# EAGLE design ESP32_DAB (EAGLE 9.6.2)
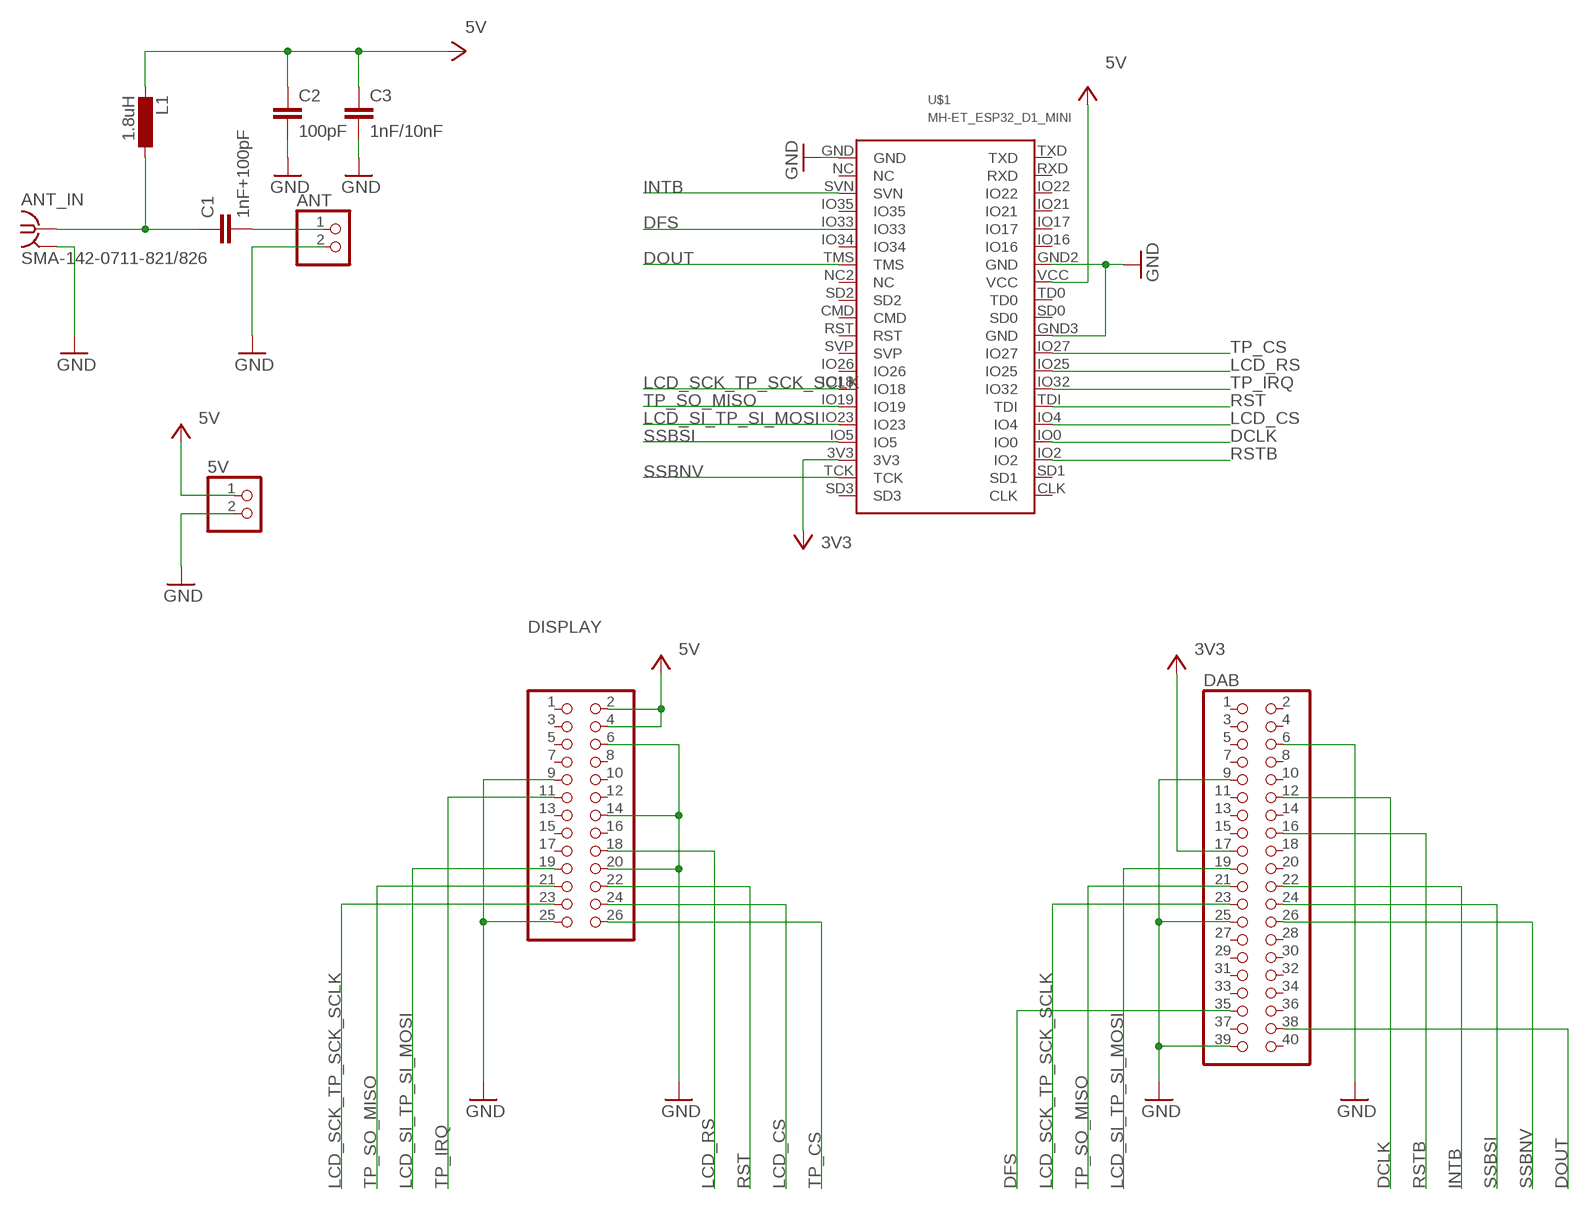
[diagram p0: schematic, sheet 1]

## Parts
5V  PINHD-1X2  [1X02]
ANT  PINHD-1X2  [1X02]
ANT_IN  SMA-142-0711-821/826  [J502-ND-142-0711-821/826]
C1  1nF+100pF  C-EUC0805  [C0805]
C2  100pF  C-EUC0805  [C0805]
C3  1nF/10nF  C-EUC0805  [C0805]
DAB  PINHD-2X20  [2X20]
DISPLAY  PINHD-2X13  [2X13]
L1  1.8uH  L-EUL1812  [L1812]
U$1  MH-ET_ESP32_D1_MINI  [MH-ET_ESP32_D1_MINI]

## Nets
3V3: DAB.17 U$1.3V3 ; supply symbol labelled VCC
5V: 5V.1 C2.1 C3.1 DISPLAY.2 DISPLAY.4 L1.2 U$1.VCC ; supply symbol labelled VCC
DCLK: DAB.12 U$1.IO0
DFS: DAB.35 U$1.IO33
DOUT: DAB.38 U$1.TMS
GND: 5V.2 ANT.2 ANT_IN.G@1 ANT_IN.G@2 ANT_IN.G@3 ANT_IN.G@4 C2.2 C3.2 DAB.6 DAB.9 DAB.25 DAB.39 DISPLAY.6 DISPLAY.9 DISPLAY.14 DISPLAY.20 DISPLAY.25 U$1.GND U$1.GND2(GND) U$1.GND3(GND)
INTB: DAB.22 U$1.SVN
LCD_CS: DISPLAY.24 U$1.IO4
LCD_RS: DISPLAY.18 U$1.IO25
LCD_SCK_TP_SCK_SCLK: DAB.23 DISPLAY.23 U$1.IO18
LCD_SI_TP_SI_MOSI: DAB.19 DISPLAY.19 U$1.IO23
N$1: ANT_IN.1 C1.1 L1.1
N$2: ANT.1 C1.2
RST: DISPLAY.22 U$1.TDI
RSTB: DAB.16 U$1.IO2
SSBNV: DAB.26 U$1.TCK
SSBSI: DAB.24 U$1.IO5
TP_CS: DISPLAY.26 U$1.IO27
TP_IRQ: DISPLAY.11 U$1.IO32
TP_SO_MISO: DAB.21 DISPLAY.21 U$1.IO19
Unconnected: DAB.1 DAB.2 DAB.3 DAB.4 DAB.5 DAB.7 DAB.8 DAB.10 DAB.11 DAB.13 DAB.14 DAB.15 DAB.18 DAB.20 DAB.27 DAB.28 DAB.29 DAB.30 DAB.31 DAB.32 DAB.33 DAB.34 DAB.36 DAB.37 DAB.40 DISPLAY.1 DISPLAY.3 DISPLAY.5 DISPLAY.7 DISPLAY.8 DISPLAY.10 DISPLAY.12 DISPLAY.13 DISPLAY.15 DISPLAY.16 DISPLAY.17 U$1.CLK U$1.CMD U$1.IO16 U$1.IO17 U$1.IO21 U$1.IO22 U$1.IO26 U$1.IO34 U$1.IO35 U$1.NC U$1.NC2(NC) U$1.RST U$1.RXD U$1.SD0 U$1.SD1 U$1.SD2 U$1.SD3 U$1.SVP U$1.TD0 U$1.TXD

## Library data of the parts
5V ANT = pinhead:PINHD-1X2: PIN HEADER
ANT_IN = con-coax:SMA-: SMA 50 Ohm End Launch Jack Receptacle - Round Contact Johnson Components Source: www.johnsoncomponents.com .. J502-ND.pdf; MF: JOHNSON COMPONENTS; MPN: 142-0711-821; OC_FARNELL: 1019328; OC_NEWARK: 16F3627
C1-C3 = rcl:C-EU: CAPACITOR, European symbol; SPICEPREFIX: C
DAB = pinhead:PINHD-2X20: PIN HEADER
DISPLAY = pinhead:PINHD-2X13: PIN HEADER
L1 = rcl:L-EU: INDUCTOR, European symbol; SPICEPREFIX: L
U$1 = MH-ET_ESP32_D1_MINI:MH-ET_ESP32_D1_MINI

## Board
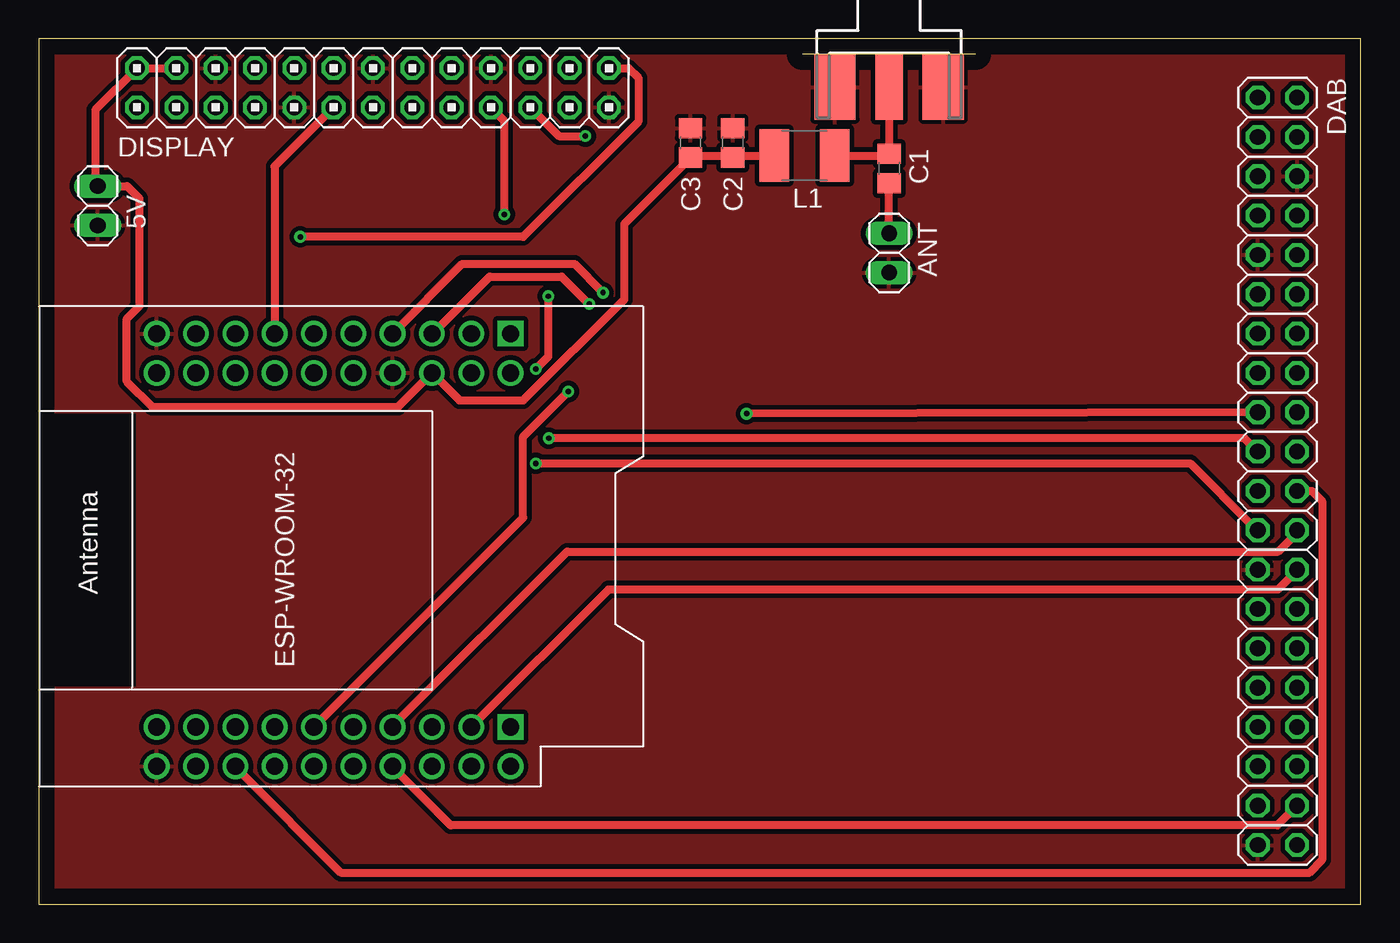
[diagram p1: board, top side]
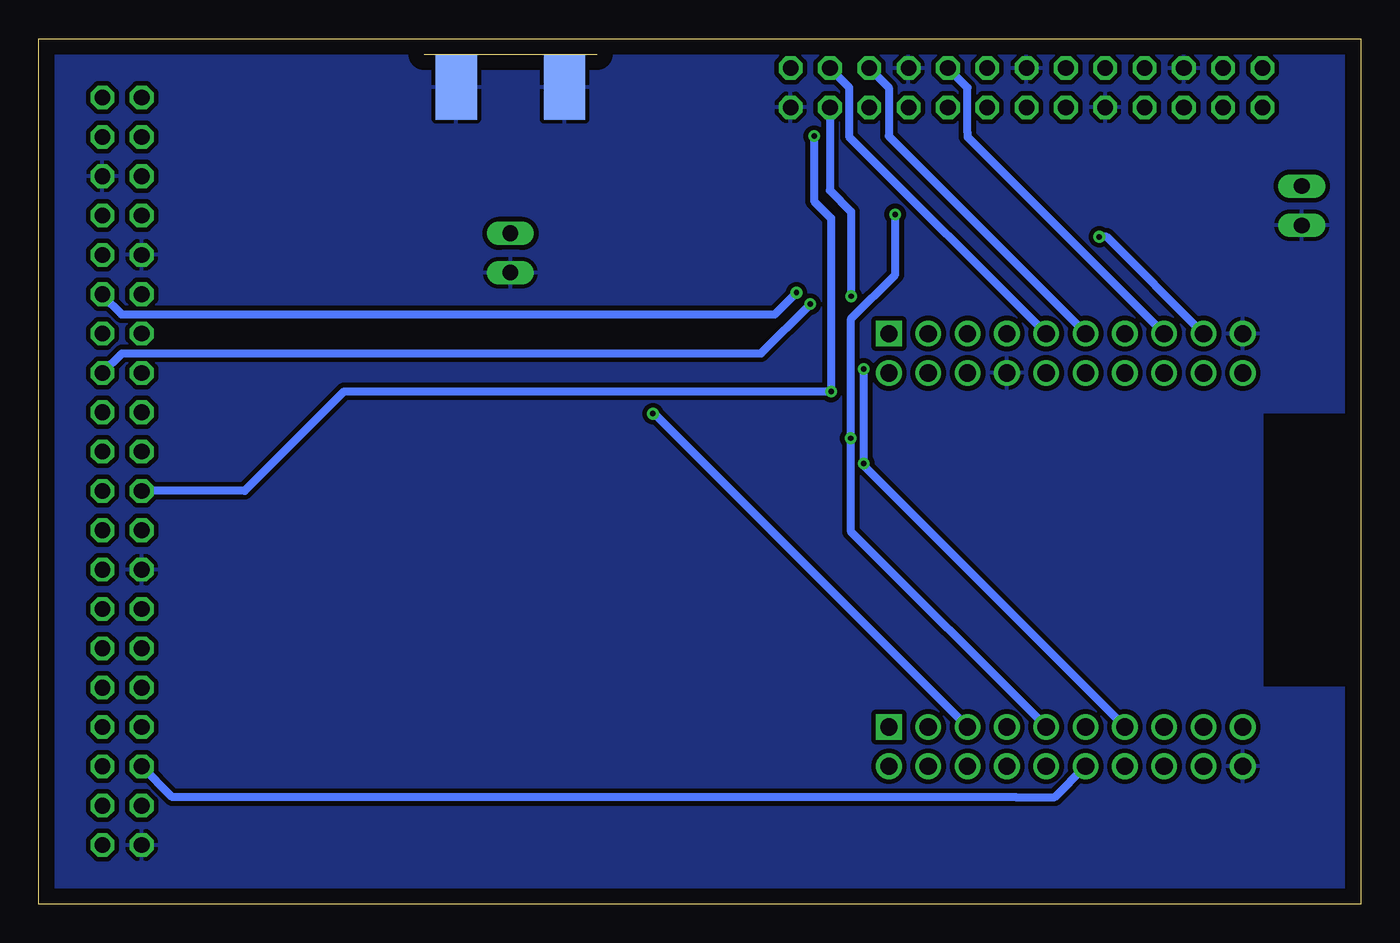
[diagram p2: board, bottom side, seen from below]

Size 85.39 x 55.87 mm. Coordinates in mm from the lower left corner, seen from the top.
Outline: 0,0 85.39,0 85.39,55.87 0,55.87 0,0
Copper layers (1*16): Top 0.035mm / dielectric 1.5mm / Bottom 0.035mm
Design rules "default *": minimum track width 20mil, minimum drill 0.35mm, track to track 12mil, track to pad 6mil, pad to pad 6mil, via to via 6mil, smd to smd 6mil, copper to edge 40mil, drill to drill 6mil, minimum pad ring 10mil, minimum via ring 8mil, stop-mask expansion 4mil, vias tented up to drill 0mil, thermal gap 10mil

### Footprints (pad centres in the part's own frame; a part is rotated, then mirrored left to right if it is on the bottom)
1X02 = drill 1.016 long: 1 -1.27,0; 2 1.27,0
J502-ND-142-0711-821/826 = smd 4.191 x 1.778: 1 2.115,0 | smd 4.191 x 2.667: G@1 2.115,3.495; G@2 2.115,-3.495 | smd 4.191 x 2.667 bottom: G@3 2.115,3.495; G@4 2.115,-3.495
C0805 = smd 1.3 x 1.5: 1 -0.95,0; 2 0.95,0
2X20 = drill 1.016 octagon: 1 -24.13,-1.27; 2 -24.13,1.27; 3 -21.59,-1.27; 4 -21.59,1.27; 5 -19.05,-1.27; 6 -19.05,1.27; 7 -16.51,-1.27; 8 -16.51,1.27; 9 -13.97,-1.27; 10 -13.97,1.27; 11 -11.43,-1.27; 12 -11.43,1.27; 13 -8.89,-1.27; 14 -8.89,1.27; 15 -6.35,-1.27; 16 -6.35,1.27; 17 -3.81,-1.27; 18 -3.81,1.27; 19 -1.27,-1.27; 20 -1.27,1.27; 21 1.27,-1.27; 22 1.27,1.27; 23 3.81,-1.27; 24 3.81,1.27; 25 6.35,-1.27; 26 6.35,1.27; 27 8.89,-1.27; 28 8.89,1.27; 29 11.43,-1.27; 30 11.43,1.27; 31 13.97,-1.27; 32 13.97,1.27; 33 16.51,-1.27; 34 16.51,1.27; 35 19.05,-1.27; 36 19.05,1.27; 37 21.59,-1.27; 38 21.59,1.27; 39 24.13,-1.27; 40 24.13,1.27
2X13 = drill 1.016 octagon: 1 -15.24,-1.27; 2 -15.24,1.27; 3 -12.7,-1.27; 4 -12.7,1.27; 5 -10.16,-1.27; 6 -10.16,1.27; 7 -7.62,-1.27; 8 -7.62,1.27; 9 -5.08,-1.27; 10 -5.08,1.27; 11 -2.54,-1.27; 12 -2.54,1.27; 13 0,-1.27; 14 0,1.27; 15 2.54,-1.27; 16 2.54,1.27; 17 5.08,-1.27; 18 5.08,1.27; 19 7.62,-1.27; 20 7.62,1.27; 21 10.16,-1.27; 22 10.16,1.27; 23 12.7,-1.27; 24 12.7,1.27; 25 15.24,-1.27; 26 15.24,1.27
L1812 = smd 1.9 x 3.4: 1 -1.95,0; 2 1.95,0
MH-ET_ESP32_D1_MINI = drill 1.11 pad 1.665: 3V3 25.4,-5.08; CMD 27.94,0; GND 0,-22.86; GND2 2.54,-7.62; GND3 27.94,-22.86; IO0 0,-7.62; IO2 0,-5.08; IO4 0,-10.16; IO5 25.4,-7.62; IO16 2.54,-10.16; IO17 2.54,-12.7; IO18 25.4,-15.24; IO19 25.4,-12.7; IO21 2.54,-15.24; IO22 2.54,-17.78; IO23 25.4,-10.16; IO25 0,-17.78; IO26 25.4,-17.78; IO27 0,-20.32; IO32 0,-15.24; IO33 27.94,-12.7; IO34 27.94,-10.16; IO35 27.94,-15.24; NC 27.94,-20.32; NC2 27.94,-5.08; RST 25.4,-22.86; RXD 2.54,-20.32; SD0 2.54,0; SD1 0,-2.54; SD2 27.94,-2.54; SVN 27.94,-17.78; SVP 25.4,-20.32; TCK 25.4,-2.54; TD0 2.54,-2.54; TDI 0,-12.7; TMS 27.94,-7.62; TXD 2.54,-22.86; VCC 2.54,-5.08 | drill 1.11 pad 1.665 square: CLK 0,0; SD3 25.4,0

### Placement (x,y rotation side)
5V  3.81,45.09 270 top
ANT  54.93,42.04 270 top
ANT_IN  54.93,54.86 270 top
C1  [C0805]  54.93,47.5 270 top
C2  [C0805]  44.83,49.15 90 top
C3  [C0805]  42.1,49.15 90 top
DAB  80.01,27.94 270 top
DISPLAY  21.59,52.7 0 top
L1  [L1812]  49.47,48.32 180 top
U$1  30.48,36.83 270 top

### Tracks (layer width: path | path; a pad name or v marks a point on that pad's centre or on a via)
3V3  (via drill 0.35)
  Top 0.508: v45.72,31.66 DAB.17
  Bottom 0.508: U$1.3V3 45.63,31.66 v45.72,31.66
5V
  Top 0.508: 42.15,48.31 C3.1 | 44.73,48.31 C2.1 | C2.1 45.14,48.31 42.21,48.31 C3.1 | 42.15,47.9 C3.1 | DISPLAY.4 DISPLAY.2 3.66,51.28 3.66,46.74 5V.1 5.71,46.35 6.5,45.57 6.5,38.61 5.69,37.8 5.69,33.73 7.32,32.11 23.22,32.11 U$1.VCC 27.18,32.51 31.29,32.51 37.81,39.03 37.81,43.91 C3.1 | C2.1 44.96,48.32 L1.2
DCLK  (via drill 0.35)
  Top 0.508: v36.45,39.47 34.59,41.33 27.36,41.33 U$1.IO0
  Bottom 0.508: DAB.12 81.28,39.31 80.05,38.08 37.85,38.08 v36.45,39.47
DFS
  Bottom 0.508: DAB.35 76.76,6.91 22.86,6.91 22.3,6.91 19.76,6.91 U$1.IO33
DOUT
  Top 0.508: U$1.TMS 23.16,8.53 26.62,5.08 80.01,5.08 DAB.38
GND
  pour Top: 0,55.88 85.09,55.88 85.09,0 0,0 0,13.97 6.35,13.97 6.35,31.75 0,31.75
  pour Bottom: 0,55.88 85.09,55.88 85.09,0 0,0 0,13.97 6.35,13.97 6.35,31.75 0,31.75
INTB
  Top 0.508: U$1.SVN 13.01,8.53 19.51,2.03 82.09,2.03 82.91,2.85 82.91,26.01 82.25,26.67 DAB.22
LCD_CS
  Bottom 0.508: U$1.IO4 33.05,49.55 33.05,52.73 DISPLAY.24
LCD_RS
  Bottom 0.508: DISPLAY.18 25.4,52.7 25.4,49.78 25.4,49.53 U$1.IO25
LCD_SCK_TP_SCK_SCLK  (via drill 0.35)
  Top 0.508: v32.92,39.24 32.92,35.36 v32.11,34.54 | v32.11,28.45 74.37,28.45 78.44,24.38 DAB.23
  Bottom 0.508: v32.92,39.24 32.92,44.7 34.29,46.08 DISPLAY.23 | v32.11,34.54 v32.11,28.45 32.11,28.3 U$1.IO18
LCD_SI_TP_SI_MOSI  (via drill 0.35)
  Top 0.508: DISPLAY.19 30.07,50.57 v30.07,44.53 | DAB.19 77.88,30.07 v32.94,30.07
  Bottom 0.508: v30.07,44.53 30.07,40.64 32.92,37.8 32.92,30.07 | 32.92,30.07 v32.94,30.07 | U$1.IO23 32.92,24.03 32.92,30.07
N$1
  Top 0.508: ANT_IN.1 C1.1 54.93,48.33 54.92,48.32 L1.1
N$2
  Top 0.508: ANT.1 C1.2
RST
  Bottom 0.508: U$1.TDI 17.88,36.98 30.48,49.58 30.48,52.7 DISPLAY.22
RSTB  (via drill 0.35)
  Top 0.508: U$1.IO2 25.6,36.98 29.13,40.51 33.78,40.51 v35.56,38.73
  Bottom 0.508: DAB.16 80.01,35.56 38.73,35.56 v35.56,38.73
SSBNV
  Top 0.508: 36.8,20.32 36.83,20.32 | 36.83,20.32 80.06,20.32 81.28,21.54 DAB.26 | U$1.TCK 36.83,20.32
SSBSI
  Top 0.508: DAB.24 81.28,23.98 80.06,22.76 34.14,22.76 23.16,11.79 U$1.IO5
TP_CS  (via drill 0.35)
  Top 0.508: v16.89,43.08 31.29,43.08 38.73,50.52 38.73,53.34 38.1,53.98 DISPLAY.26
  Bottom 0.508: 16.66,43.08 v16.89,43.08 16.41,43.08 U$1.IO27
TP_IRQ
  Top 0.508: DISPLAY.11 15.24,47.62 U$1.IO32
TP_SO_MISO  (via drill 0.35)
  Top 0.508: DISPLAY.21 33.6,49.58 v35.31,49.58 | v34.21,33.1 31.29,30.18 31.29,24.94 U$1.IO19
  Bottom 0.508: DAB.21 72.08,26.67 65.66,33.1 v34.21,33.1 34.21,44.29 35.31,45.38 v35.31,49.58